# EAGLE design coin20mm - switched (EAGLE 6.6.0)
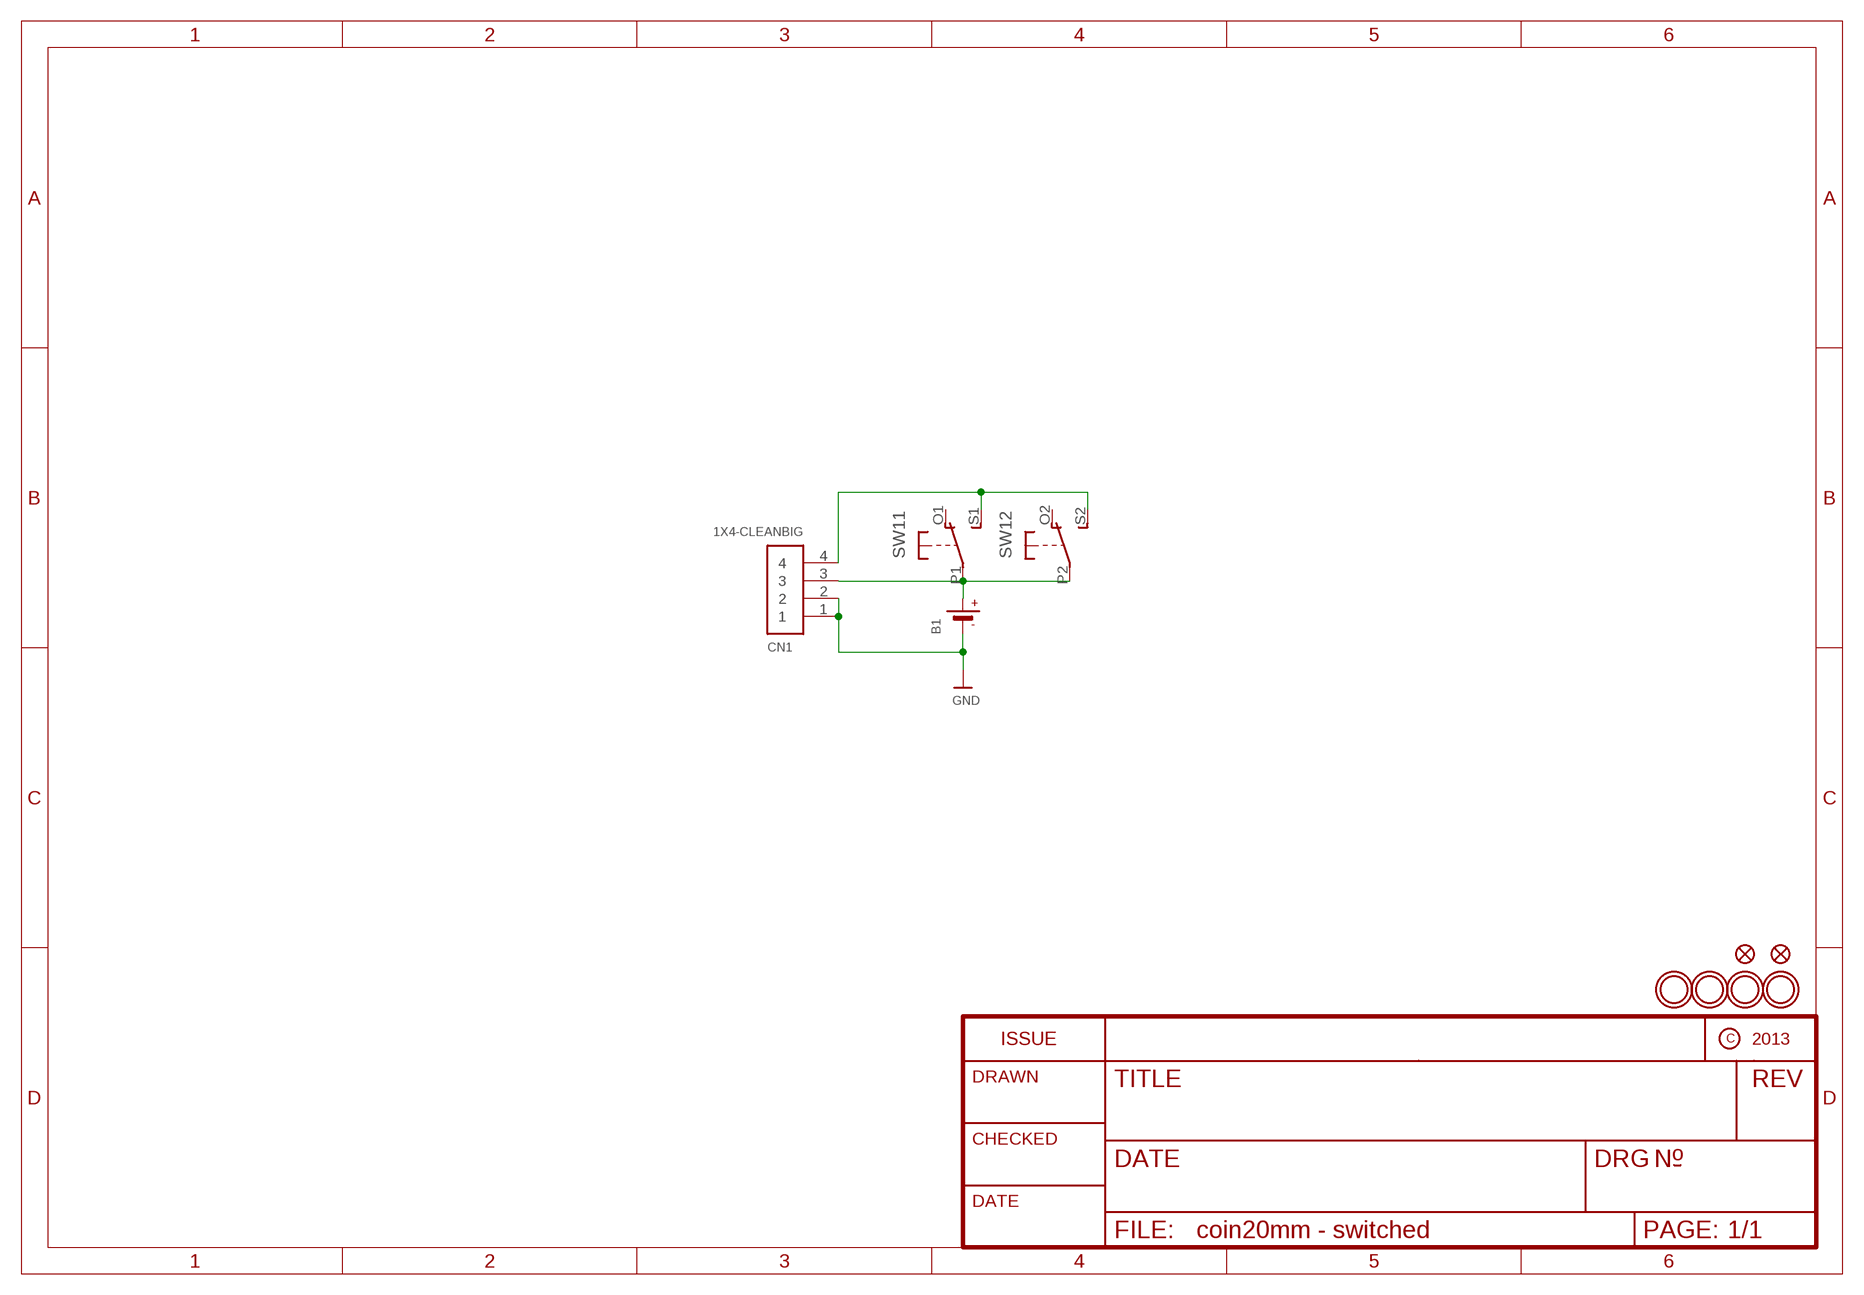
[diagram p0: schematic, sheet 1]

## Parts
B1  BATTERYCR2032_BAT-HLD-001  [CR2032_SMT_BAT-HLD-001]
CN1  1X4-CLEANBIG  [1X04-CLEANBIG]
FID1  FIDUCIAL""  [FIDUCIAL_1MM]
FID2  FIDUCIAL""  [FIDUCIAL_1MM]
SW1  DPDT-EG1390  [EG1390]
U$1  MOUNTINGHOLE2.5  [MOUNTINGHOLE_2.5_PLATED]
U$2  MOUNTINGHOLE2.5  [MOUNTINGHOLE_2.5_PLATED]
U$3  MOUNTINGHOLE2.5  [MOUNTINGHOLE_2.5_PLATED]
U$5  MOUNTINGHOLE2.5  [MOUNTINGHOLE_2.5_PLATED]

## Nets
3V: B1.+$1(+) B1.+$2(+) CN1.3 SW1.P1(1:P) SW1.P2(2:P)
GND: B1.- CN1.1 CN1.2
N$3: CN1.4 SW1.S1(1:S) SW1.S2(2:S)
Unconnected: SW1.O1(1:O) SW1.O2(2:O)

## Library data of the parts
B1 = microbuilder:BATTERY: CR1220 SMT - Digikey: 3001K-ND CD2032 BAT-HLD-001 - Digikey: BAT-HLD-001-ND
CN1 = adafruit2:1X4: 4-pin connector
FID1 FID2 = microbuilder:FIDUCIAL: Fiducial Alignment Points Various fiducial points for machine vision alignment.; BOM: EXCLUDE
SW1 = adafruit:DPDT
U$1-U$3 U$5 = microbuilder:MOUNTINGHOLE: Mounting Hole For #2 screws (0.086"/2.18mm width, 0.094"/2.4mm hole) use 2.5mm; BOM: EXCLUDE

## Board
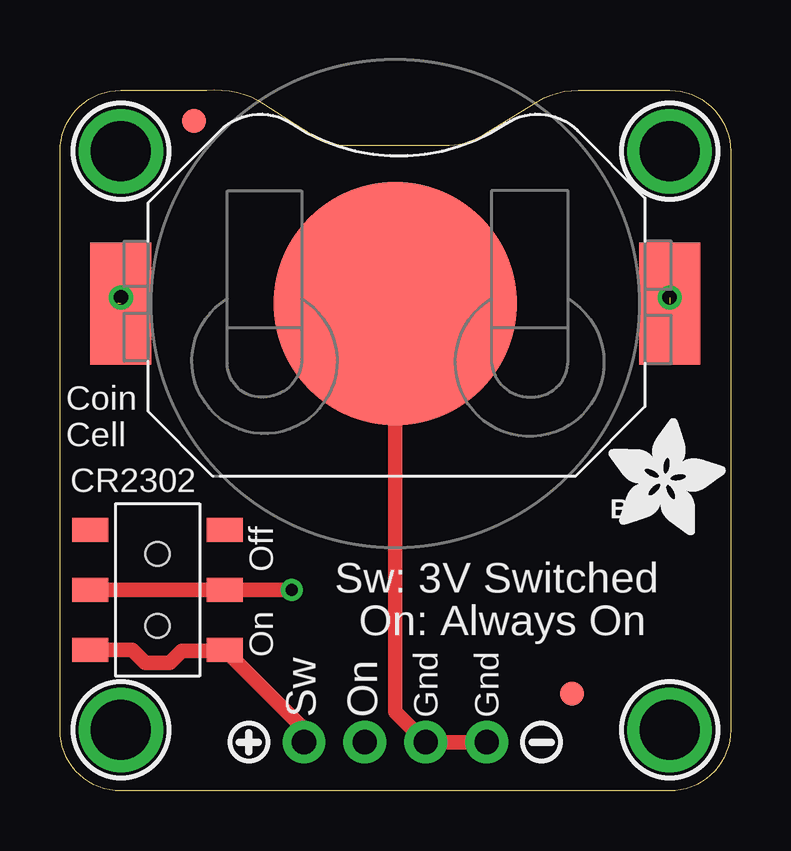
[diagram p1: board, top side]
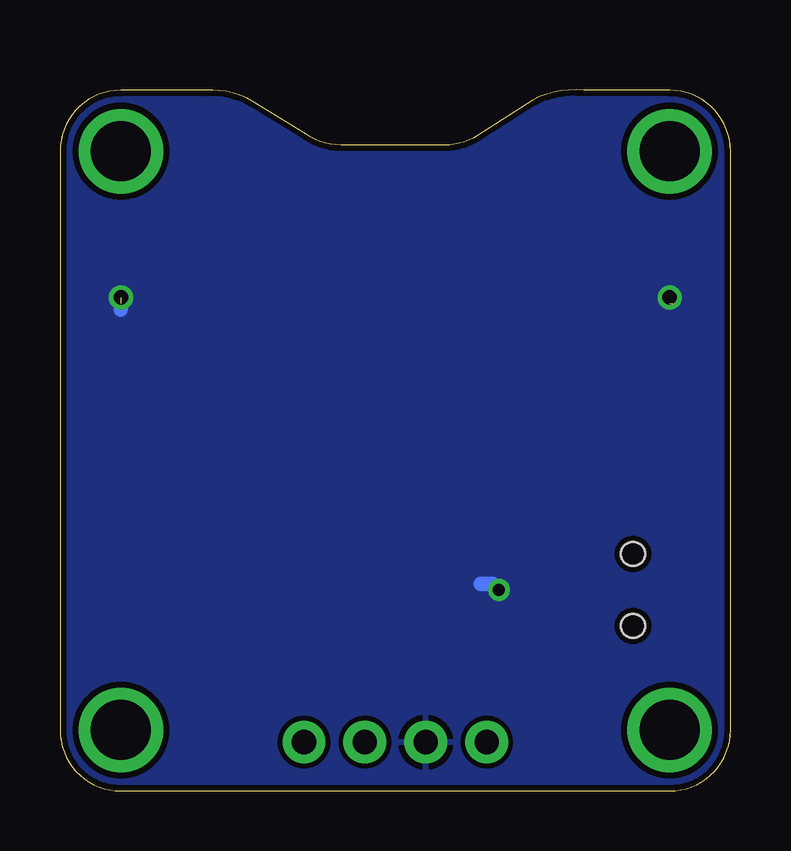
[diagram p2: board, bottom side, seen from below]

Size 27.94 x 29.23 mm. Coordinates in mm from the lower left corner, seen from the top.
Outline: 27.94,26.67 27.94,2.54 arc-90 25.4,0 2.54,0 arc-90 0,2.54 0,26.67 arc-90 2.54,29.21 6.11,29.21 arc-33 8.25,28.81 10.55,27.33 arc33 11.92,26.92 16.23,26.92 arc35 17.67,27.38 19.92,28.76 arc-35 21.88,29.21 25.4,29.21 arc-90 27.94,26.67
Copper layers (1*16): Top 0.035mm / dielectric 1.5mm / Bottom 0.035mm
Design rules "adafruit": minimum track width 8mil, minimum drill 15.5mil, track to track 8mil, track to pad 8mil, pad to pad 8mil, via to via 8mil, smd to smd 8mil, copper to edge 10mil, drill to drill 8mil, minimum pad ring 10mil, minimum via ring 8mil, stop-mask expansion 2mil, vias tented up to drill 20mil, thermal gap 10mil

### Footprints (pad centres in the part's own frame; a part is rotated, then mirrored left to right if it is on the bottom)
CR2032_SMT_BAT-HLD-001 = smd 2.54 x 5.08: +$1 -11.43,0; +$2 11.43,0 | smd 10.16 x 10.16: - 0,0
1X04-CLEANBIG = drill 1.016 pad 1.778: 1 -3.81,0; 2 -1.27,0; 3 1.27,0; 4 3.81,0
FIDUCIAL_1MM = smd 1 x 1: 1 0,0
EG1390 = smd 1 x 1.5: O1 -2.5,2.8; O2 -2.5,-2.8; P1 0,2.8; P2 0,-2.8; S1 2.5,2.8; S2 2.5,-2.8 | hole 1: 1.5,0; -1.5,0
MOUNTINGHOLE_2.5_PLATED = drill 2.5 pad 3.2: P$1 0,0

### Placement (x,y rotation side)
B1  13.97,20.32 180 top
CN1  13.97,2.03 180 top
FID1  21.34,4.06 0 top
FID2  5.59,27.94 0 top
SW1  4.06,8.38 270 top
U$1  2.54,26.67 0 top
U$2  25.4,26.67 0 top
U$3  2.54,2.54 0 top
U$5  25.4,2.54 0 top
U$6  [SYMBOL_PLUS]  7.87,2.03 0 top
U$7  [SYMBOL_MINUS]  20.07,2.03 0 top
U$8  [ADAFRUIT_5MM]  22.86,10.67 0 top

### Tracks (layer width: path | path; a pad name or v marks a point on that pad's centre or on a via)
3V  (via drill 0.5, 0.6)  (2 unrouted)
  Top 0.61: SW1.P2 SW1.P1 v9.65,8.38 | 12.7,2.55 CN1.3 | v25.4,20.57 25.4,19.94 | 2.41,20.32 v2.54,20.57
  Bottom 0.61: v25.4,20.57 25.4,20.07 | v9.65,8.38 9.91,8.64 10.41,8.64
  pour Bottom: 0,29.21 27.94,29.21 27.94,0 0,0
GND
  Top 0.61: CN1.1 CN1.2 13.97,3.3 B1.-
N$3
  Top 0.61: SW1.S2 3.01,5.88 3.56,5.33 4.57,5.33 5.08,5.84 6.82,5.84 SW1.S1 10.16,2.59 CN1.4

### Text on the board
tPlace: Coin / Cell | CR2302 | Off | Sw: 3V Switched | On | On: Always On | Sw | On | Gnd | Gnd